# Altium project Arduino Board.PrjPcb
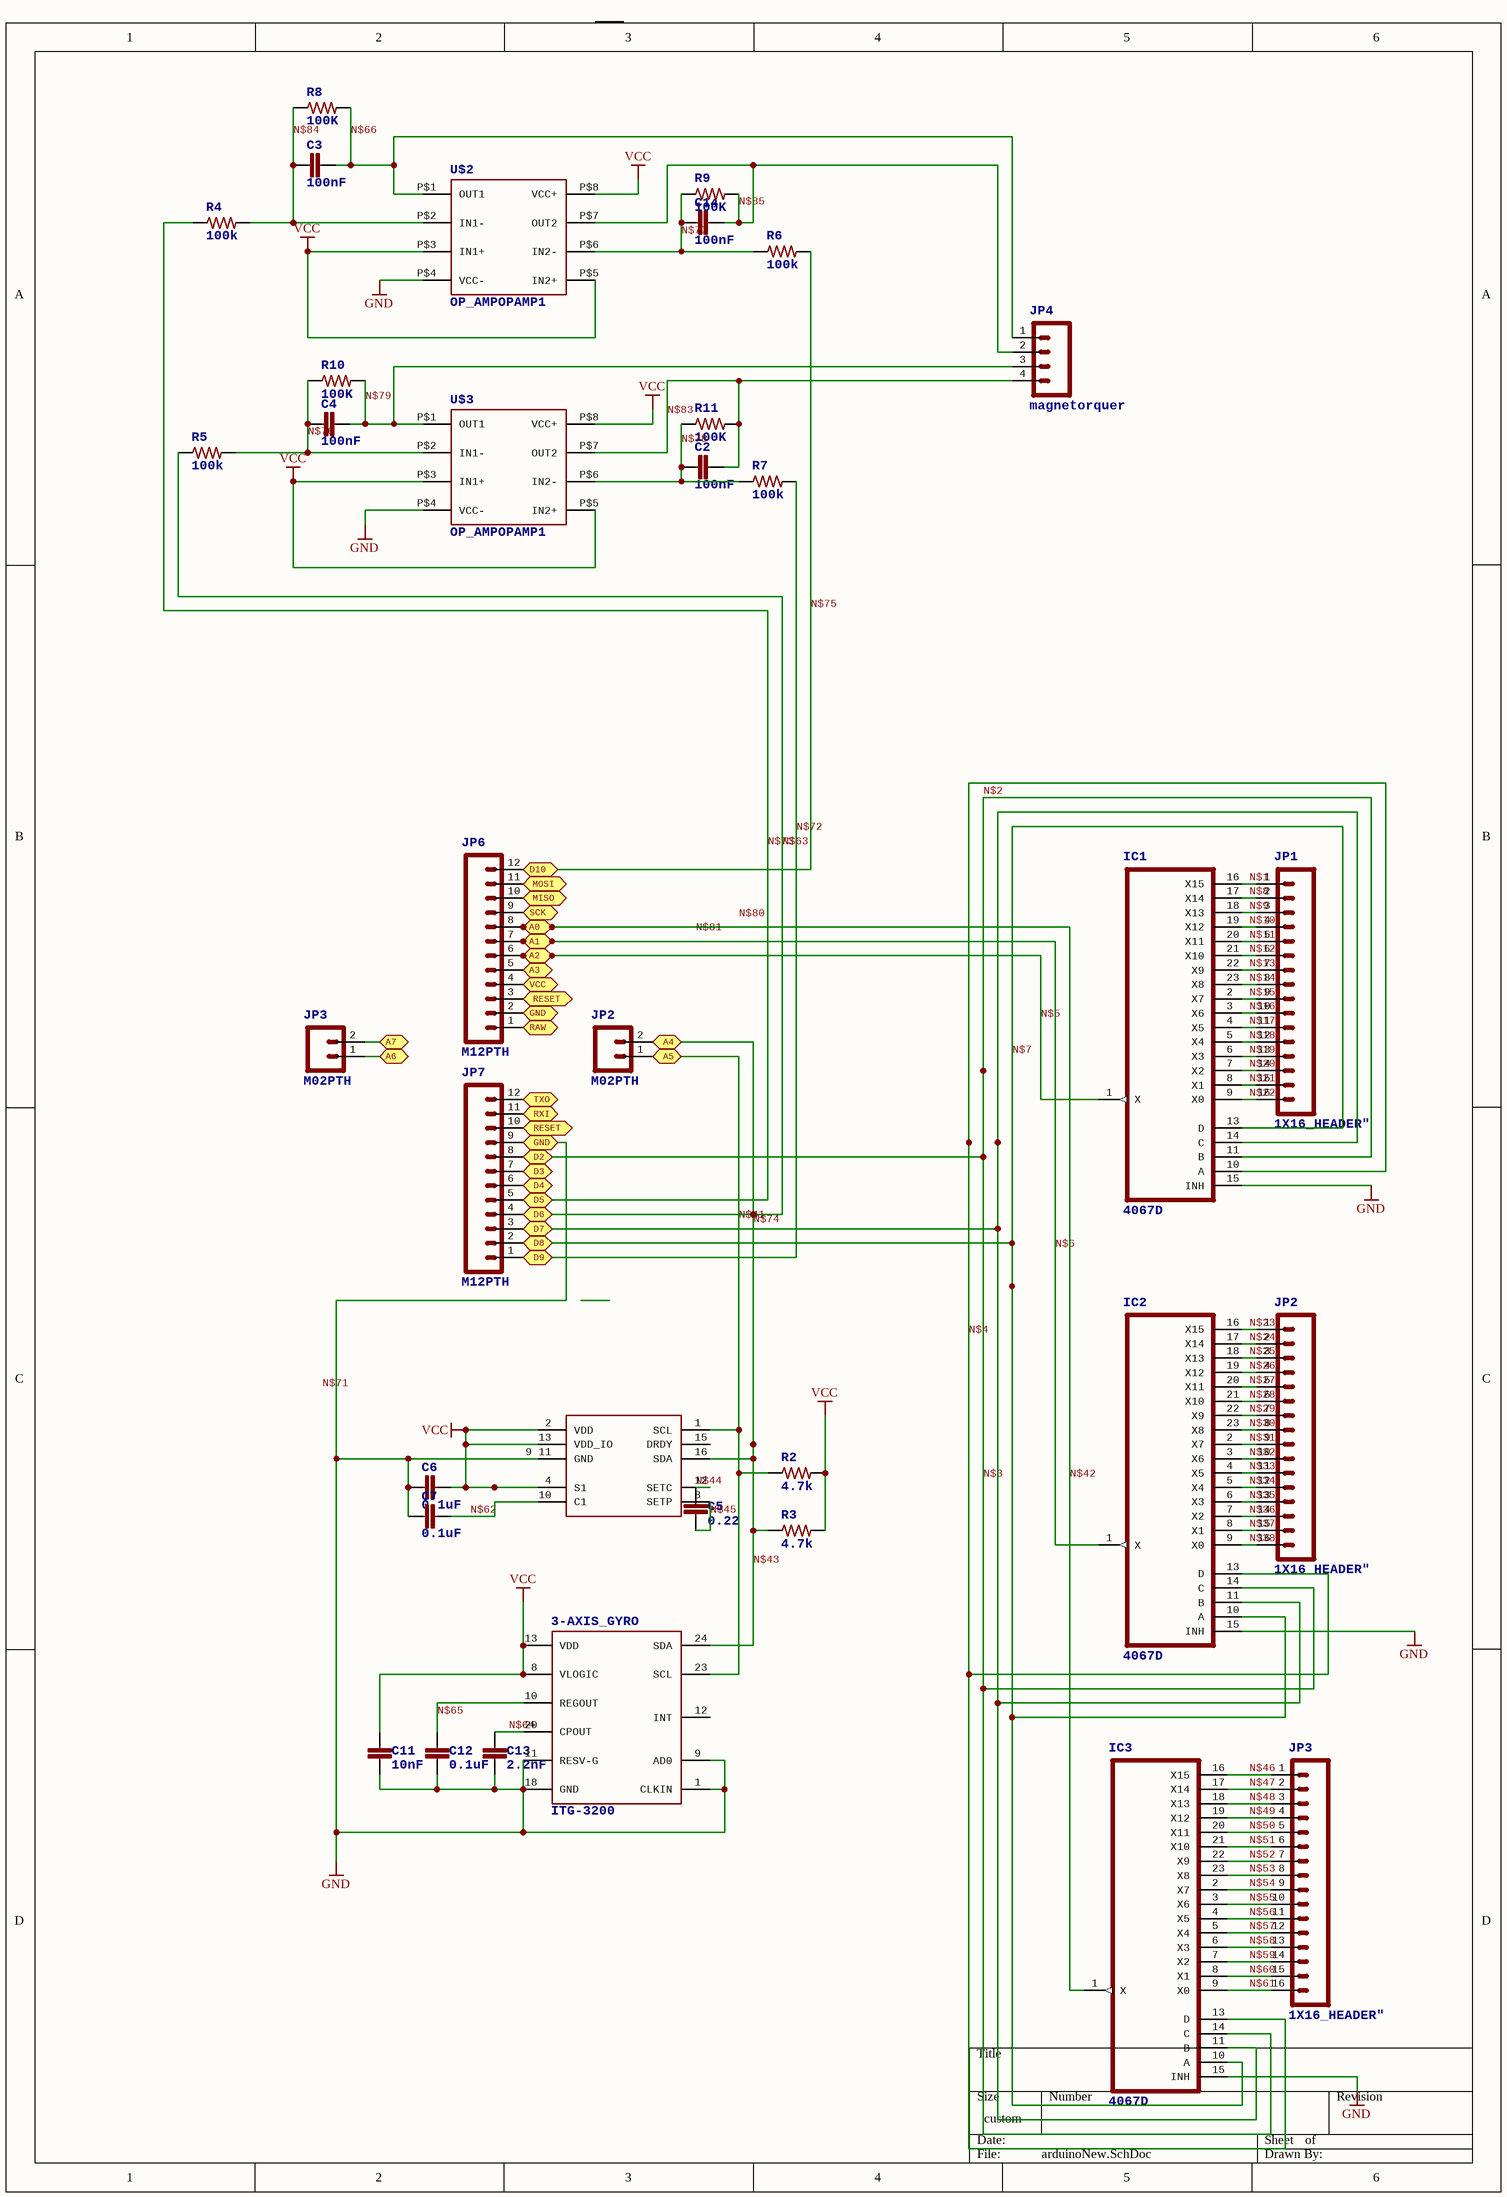
[diagram p0: arduinoNew.SchDoc]
4 sheets, 122 parts. Net scope: flat (ports and power ports of the same name join across sheets).
Sheets:
  arduinoNew.SchDoc
  arduino.SchDoc
  Arduino-Pro-Mini.SchDoc
  magnetorquer_shield.SchDoc

## Sheet arduinoNew.SchDoc
size 264 x 383 mm

### Parts
(Parts that share a designator on the sheet are numbered #1, #2 ... from top to bottom, then left to right.)
3-AXIS_GYRO#1  ITG-3200  [QFN-24]
3-AXIS_MAG#1  HMC5883L  [LPCC16]  (value not drawn)
C2#1  100nF  [0402-CAP]
C3#1  100nF  [0402-CAP]
C4#1  100nF  [0402-CAP]
C5#1  0.22  [0402-CAP]
C6#1  0.1uF  [0402-CAP]
C7#1  0.1uF  [0402-CAP]
C11#1  10nF  [0402-CAP]
C12#1  0.1uF  [0402-CAP]
C13#1  2.2nF  [0402-CAP]
C14#1  100nF  [0402-CAP]
IC1#1  4067D  [SO24W]
IC2#1  4067D  [SO24W]
IC3#1  4067D  [SO24W]
JP1#1  1X16_HEADER"  [1X16_HEADER]
JP2#1  M02PTH  [1X02]
JP2#2  1X16_HEADER"  [1X16_HEADER]
JP3#1  M02PTH  [1X02]
JP3#2  1X16_HEADER"  [1X16_HEADER]
JP4#1  magnetorquer  [1X04_HEADER]
JP6#1  M12PTH  [1X12]
JP7#1  M12PTH  [1X12]
R2#1  4.7k  [0805]
R3#1  4.7k  [0805]
R4#1  100k  [0805]
R5#1  100k  [0805]
R6#1  100k  [0805]
R7#1  100k  [0805]
R8#1  100K  [0805]
R9#1  100K  [0805]
R10#1  100K  [0805]
R11#1  100K  [0805]
U$2#1  OP_AMPOPAMP1  [OPAMP]
U$3#1  OP_AMPOPAMP1  [OPAMP]

### Ports
A0, A1, A2, A3, A4, A5, A6, A7, D2, D3, D4, D5, D6, D7, D8, D9, D10, GND, MISO, MOSI, RAW, RESET, RXI, SCK, TXO, VCC

### Nets
GND: 3-AXIS_GYRO#1.1(CLKIN) 3-AXIS_GYRO#1.9(AD0) 3-AXIS_GYRO#1.11(RESV-G) 3-AXIS_GYRO#1.18(GND) 3-AXIS_MAG#1.9_11(GND) C6#1.1 C7#1.1 C11#1.2 C12#1.2 C13#1.2 IC1#1.15(INH) IC2#1.15(INH) IC3#1.15(INH) JP6#1.2 JP7#1.9 U$2#1.P$4(VCC-) U$3#1.P$4(VCC-) ; port GND
VCC: 3-AXIS_GYRO#1.8(VLOGIC) 3-AXIS_GYRO#1.13(VDD) 3-AXIS_MAG#1.2(VDD) 3-AXIS_MAG#1.4(S1) 3-AXIS_MAG#1.13(VDD_IO) C6#1.2 C11#1.1 R2#1.2 R3#1.2 U$2#1.P$3(IN1+) U$2#1.P$5(IN2+) U$2#1.P$8(VCC+) U$3#1.P$3(IN1+) U$3#1.P$5(IN2+) U$3#1.P$8(VCC+)
N$1: IC1#1.16(X15) JP1#1.1
N$2: IC1#1.11(B) IC2#1.14(C) IC3#1.14(C) JP7#1.8 ; port D2  [also labelled N$3]
N$4: IC1#1.10(A) IC2#1.13(D) IC3#1.13(D)
N$5: IC1#1.1(X) JP6#1.6 ; port A2
N$6: IC2#1.1(X) JP6#1.7 ; port A1
N$7: IC1#1.13(D) IC2#1.10(A) IC3#1.10(A) JP7#1.2 ; port D8
N$8: IC1#1.17(X14) JP1#1.2
N$9: IC1#1.18(X13) JP1#1.3
N$10: IC1#1.19(X12) JP1#1.4
N$11: IC1#1.20(X11) JP1#1.5
N$12: IC1#1.21(X10) JP1#1.6
N$13: IC1#1.22(X9) JP1#1.7
N$14: IC1#1.23(X8) JP1#1.8
N$15: IC1#1.2(X7) JP1#1.9
N$16: IC1#1.3(X6) JP1#1.10
N$17: IC1#1.4(X5) JP1#1.11
N$18: IC1#1.5(X4) JP1#1.12
N$19: IC1#1.6(X3) JP1#1.13
N$20: IC1#1.7(X2) JP1#1.14
N$21: IC1#1.8(X1) JP1#1.15
N$22: IC1#1.9(X0) JP1#1.16
N$23: IC2#1.16(X15) JP2#2.1
N$24: IC2#1.17(X14) JP2#2.2
N$25: IC2#1.18(X13) JP2#2.3
N$26: IC2#1.19(X12) JP2#2.4
N$27: IC2#1.20(X11) JP2#2.5
N$28: IC2#1.21(X10) JP2#2.6
N$29: IC2#1.22(X9) JP2#2.7
N$30: IC2#1.23(X8) JP2#2.8
N$31: IC2#1.2(X7) JP2#2.9
N$32: IC2#1.3(X6) JP2#2.10
N$33: IC2#1.4(X5) JP2#2.11
N$34: IC2#1.5(X4) JP2#2.12
N$35: IC2#1.6(X3) JP2#2.13
N$36: IC2#1.7(X2) JP2#2.14
N$37: IC2#1.8(X1) JP2#2.15
N$38: IC2#1.9(X0) JP2#2.16
N$41: 3-AXIS_GYRO#1.23(SCL) 3-AXIS_MAG#1.1(SCL) JP2#1.1 R2#1.1 ; port A5
N$42: IC3#1.1(X) JP6#1.8 ; port A0
N$43: 3-AXIS_GYRO#1.24(SDA) 3-AXIS_MAG#1.16(SDA) JP2#1.2 JP7#1.4 R3#1.1 R5#1.1 ; port D6, port A4  [also labelled N$63, N$74]
N$44: 3-AXIS_MAG#1.12(SETC) C5#1.1
N$45: 3-AXIS_MAG#1.8(SETP) C5#1.2
N$46: IC3#1.16(X15) JP3#2.1
N$47: IC3#1.17(X14) JP3#2.2
N$48: IC3#1.18(X13) JP3#2.3
N$49: IC3#1.19(X12) JP3#2.4
N$50: IC3#1.20(X11) JP3#2.5
N$51: IC3#1.21(X10) JP3#2.6
N$52: IC3#1.22(X9) JP3#2.7
N$53: IC3#1.23(X8) JP3#2.8
N$54: IC3#1.2(X7) JP3#2.9
N$55: IC3#1.3(X6) JP3#2.10
N$56: IC3#1.4(X5) JP3#2.11
N$57: IC3#1.5(X4) JP3#2.12
N$58: IC3#1.6(X3) JP3#2.13
N$59: IC3#1.7(X2) JP3#2.14
N$60: IC3#1.8(X1) JP3#2.15
N$61: IC3#1.9(X0) JP3#2.16
N$62: 3-AXIS_MAG#1.10(C1) C7#1.2
N$64: 3-AXIS_GYRO#1.20(CPOUT) C13#1.1
N$65: 3-AXIS_GYRO#1.10(REGOUT) C12#1.1
N$66: C3#1.2 JP4#1.1 R8#1.2 U$2#1.P$1(OUT1)
N$72: JP7#1.1 R7#1.2 ; port D9
N$73: JP7#1.5 R4#1.1 ; port D5
N$75: JP6#1.12 R6#1.2 ; port D10
N$76: C4#1.1 R5#1.2 R10#1.1 U$3#1.P$2(IN1-)
N$77: C14#1.1 R6#1.1 R9#1.1 U$2#1.P$6(IN2-)
N$78: C2#1.1 R7#1.1 R11#1.1 U$3#1.P$6(IN2-)
N$79: C4#1.2 JP4#1.3 R10#1.2 U$3#1.P$1(OUT1)
N$83: C2#1.2 JP4#1.4 R11#1.2 U$3#1.P$7(OUT2)
N$84: C3#1.1 R4#1.2 R8#1.1 U$2#1.P$2(IN1-)
N$85: C14#1.2 JP4#1.2 R9#1.2 U$2#1.P$7(OUT2)
NetC19_A: JP6#1.1 ; port RAW
NetIC1#1_14: IC1#1.14(C) IC2#1.11(B) IC3#1.11(B) JP7#1.3 ; port D7
NetJP1#3_2: JP7#1.12 ; port TXO
NetJP1#3_3: JP7#1.11 ; port RXI
NetJP1#3_4: JP6#1.4 ; port VCC
NetJP3#1_1: JP3#1.1 ; port A6
NetJP3#1_2: JP3#1.2 ; port A7
NetJP6#1_3: JP6#1.3 JP7#1.10 ; port RESET
NetJP6#1_5: JP6#1.5 ; port A3
NetJP6#1_9: JP6#1.9 ; port SCK
NetJP6#1_10: JP6#1.10 ; port MISO
NetJP6#1_11: JP6#1.11 ; port MOSI
NetJP7#1_6: JP7#1.6 ; port D4
NetJP7#1_7: JP7#1.7 ; port D3

Not connected (* = marked no-connect by the designer): 3-AXIS_GYRO#1 12(INT); 3-AXIS_MAG#1 15(DRDY)

### Notes on the sheet
- Labels drawn without touching a wire or pin: N$71, N$80, N$81

### Library data of the parts
3-AXIS_GYRO#1 = ITG-3200: ITG-3200 3-axis gyro, digital output, qfn24 package
C2#1 C3#1 C4#1 C5#1 C6#1 C7#1 C11#1 C12#1 C13#1 C14#1 = CAP0402-CAP: CapacitorStandard 0603 ceramic capacitor, and 0.1" leaded capacitor.
IC1#1 IC2#1 IC3#1 = 4067D: 16-channel ANALOG MULTIPLEXER
JP2#1 JP3#1 = M02PTH: Header 2Standard 2-pin 0.1" header. Use with straight break away headers (SKU : PRT-00116), right angle break away headers (PRT-00553), swiss pins (PRT-00743), machine pins (PRT-00117), and female headers (PRT-00115). Molex polarized connector foot print use with SKU : PRT-08233 with associated crimp pins and housings.
JP4#1 = 1X04_HEADER": Header 4Standard 4-pin 0.1" header. Use with straight break away headers (SKU : PRT-00116), right angle break away headers (PRT-00553), swiss pins (PRT-00743), machine pins (PRT-00117), and female headers (PRT-00115). Molex polarized connector foot print use with SKU : PRT-08231 with associated crimp pins and housings.
JP6#1 JP7#1 = M12PTH: Header 12Standard 12-pin 0.1" header. Use with straight break away headers (SKU : PRT-00116), right angle break away headers (PRT-00553), swiss pins (PRT-00743), machine pins (PRT-00117), and female headers (PRT-00115).
R2#1 R3#1 R4#1 R5#1 R6#1 R7#1 R8#1 R9#1 R10#1 R11#1 = RESISTOR: ResistorBasic schematic elements and footprints for 0603, 1206, and PTH 1/10th watt (small) resistors.

## Sheet arduino.SchDoc
size 264 x 383 mm
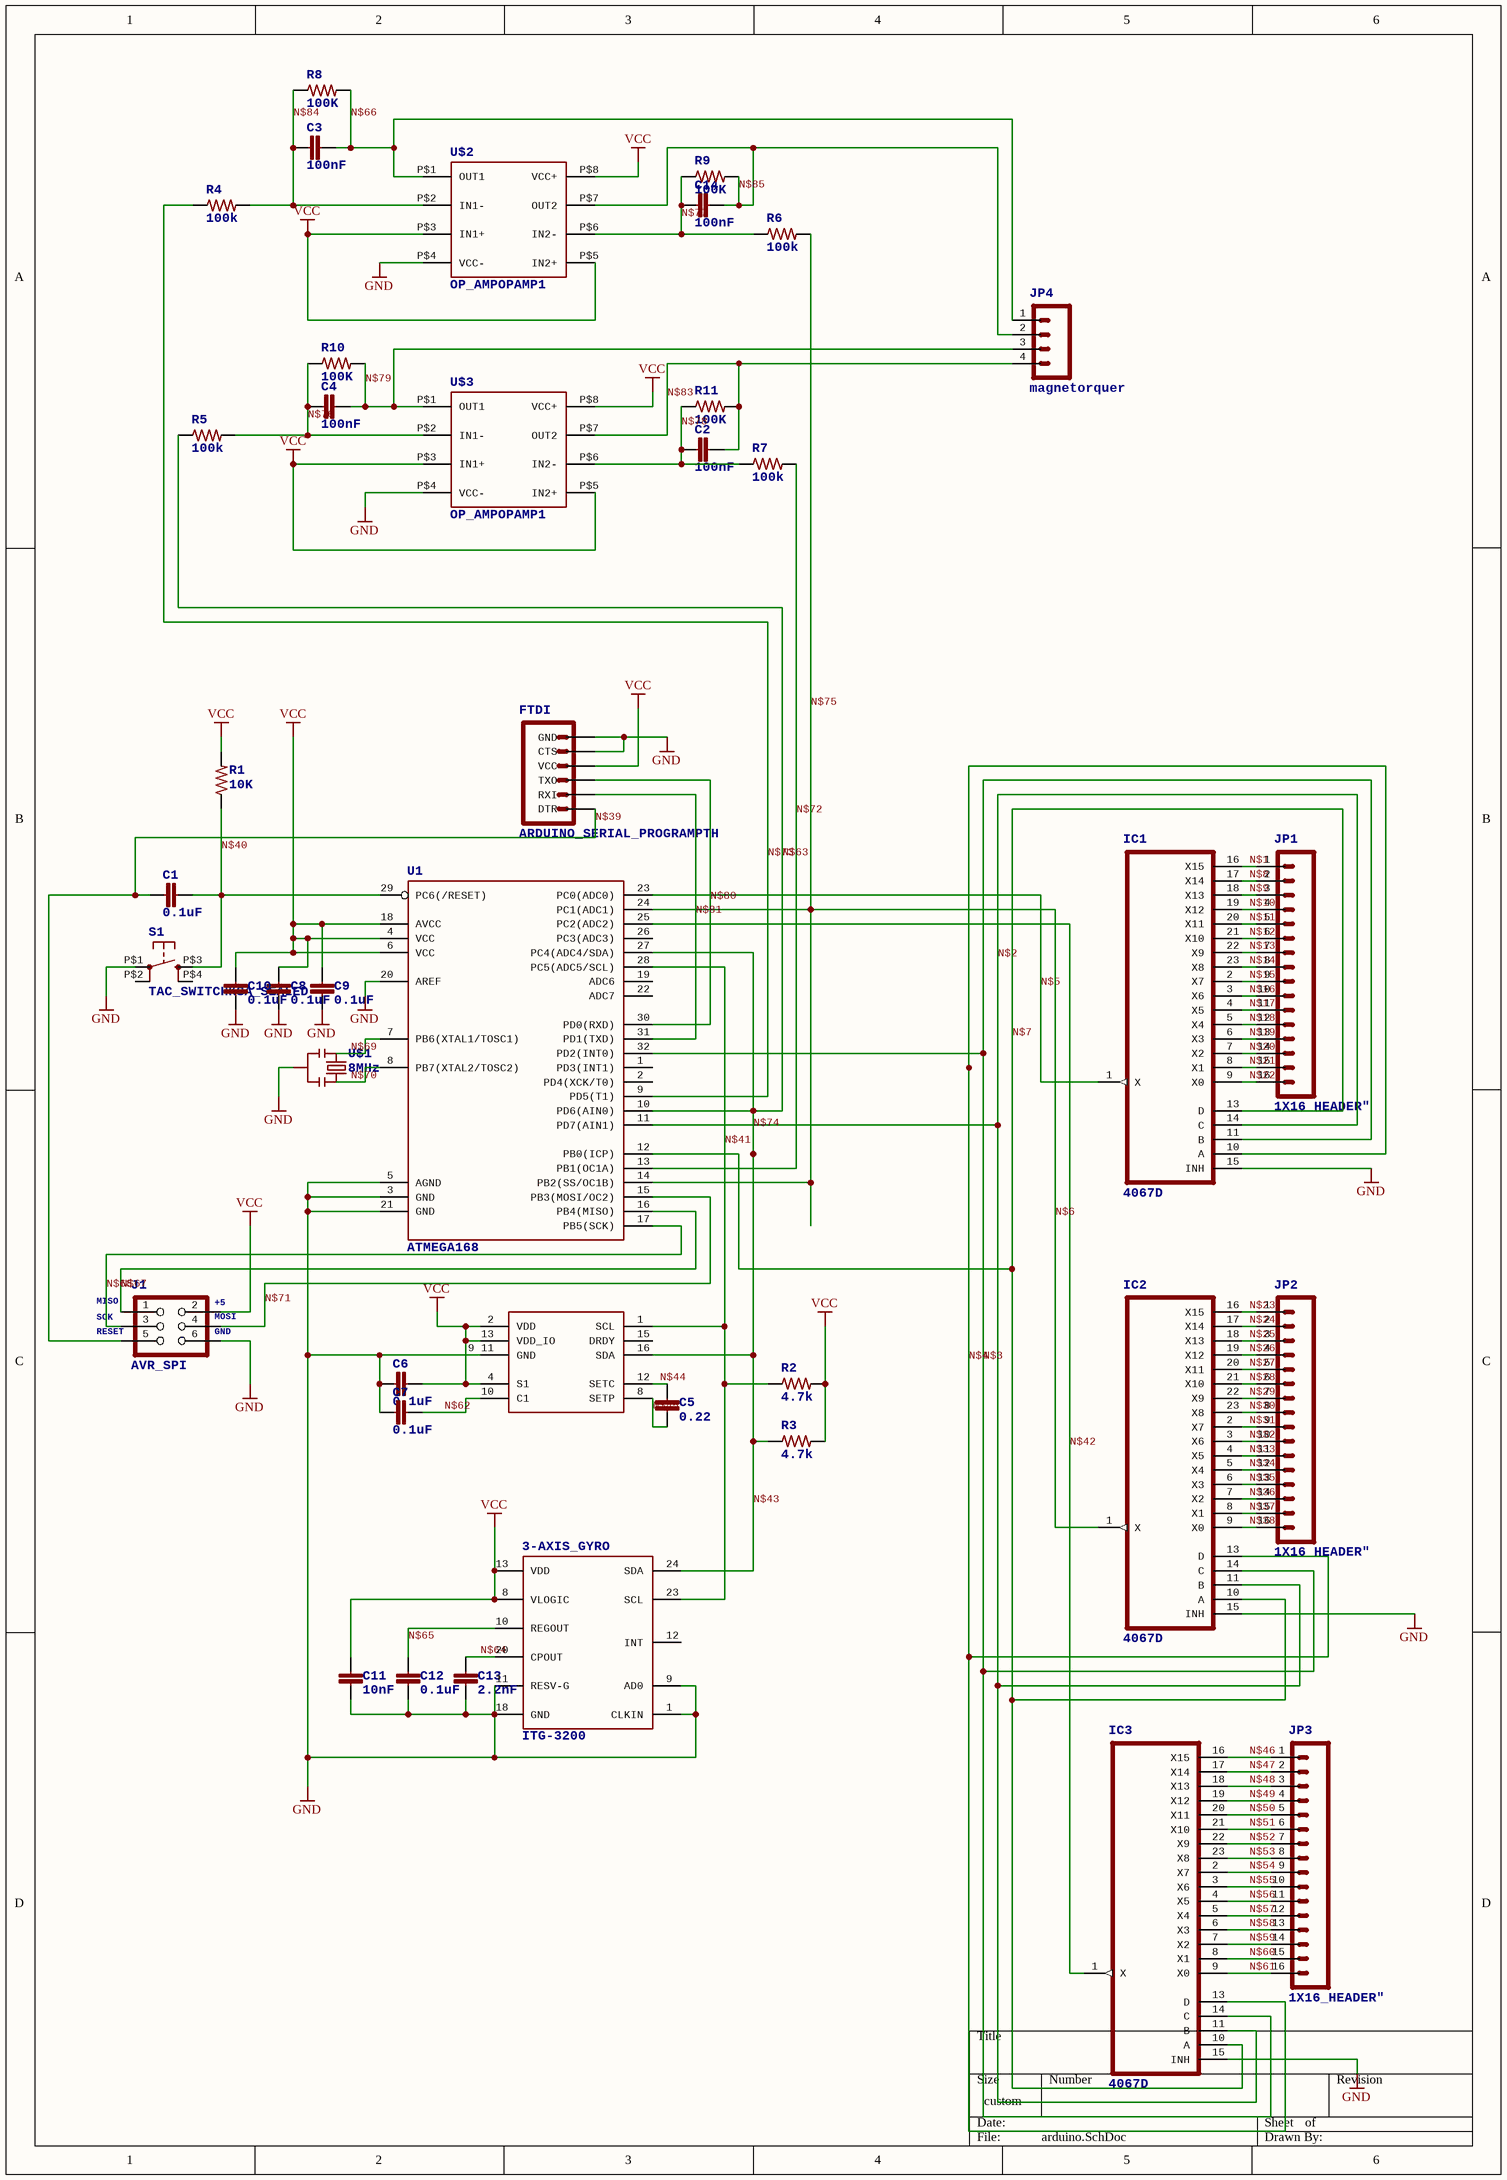
[diagram p1: arduino.SchDoc]

### Parts
(Parts that share a designator on the sheet are numbered #1, #2 ... from top to bottom, then left to right.)
3-AXIS_GYRO#2  ITG-3200  [QFN-24]
3-AXIS_MAG#2  HMC5883L  [LPCC16]  (value not drawn)
C1#1  0.1uF  [0603-CAP]
C2#2  100nF  [0402-CAP]
C3#2  100nF  [0402-CAP]
C4#2  100nF  [0402-CAP]
C5#2  0.22  [0402-CAP]
C6#2  0.1uF  [0402-CAP]
C7#2  0.1uF  [0402-CAP]
C8  0.1uF  [0603-CAP]
C9  0.1uF  [0603-CAP]
C10#1  0.1uF  [0603-CAP]
C11#2  10nF  [0402-CAP]
C12#2  0.1uF  [0402-CAP]
C13#2  2.2nF  [0402-CAP]
C14#2  100nF  [0402-CAP]
FTDI  ARDUINO_SERIAL_PROGRAMPTH  [1X06]
IC1#2  4067D  [SO24W]
IC2#2  4067D  [SO24W]
IC3#2  4067D  [SO24W]
J1  AVR_SPI  [2X3]
JP1#2  1X16_HEADER"  [1X16_HEADER]
JP2#3  1X16_HEADER"  [1X16_HEADER]
JP3#3  1X16_HEADER"  [1X16_HEADER]
JP4#2  magnetorquer  [1X04_HEADER]
R1#1  10K  [0805]
R2#2  4.7k  [0805]
R3#2  4.7k  [0805]
R4#2  100k  [0805]
R5#2  100k  [0805]
R6#2  100k  [0805]
R7#2  100k  [0805]
R8#2  100K  [0805]
R9#2  100K  [0805]
R10#2  100K  [0805]
R11#2  100K  [0805]
S1#1  TAC_SWITCHKSA_SEALED  [KSA_SEALED_TAC_SWITCH]
U1#1  ATMEGA168  [TQFP32-08]
U$1#1  8MHz  [RESONATOR]
U$2#2  OP_AMPOPAMP1  [OPAMP]
U$3#2  OP_AMPOPAMP1  [OPAMP]

### Nets
GND: 3-AXIS_GYRO#2.1(CLKIN) 3-AXIS_GYRO#2.9(AD0) 3-AXIS_GYRO#2.11(RESV-G) 3-AXIS_GYRO#2.18(GND) 3-AXIS_MAG#2.9_11(GND) C6#2.1 C7#2.1 C8.2 C9.2 C10#1.2 C11#2.2 C12#2.2 C13#2.2 FTDI.5(CTS) FTDI.6(GND) IC1#2.15(INH) IC2#2.15(INH) IC3#2.15(INH) J1.6 S1#1.P$1 U1#1.3(GND) U1#1.5(AGND) U1#1.20(AREF) U1#1.21(GND) U$1#1.2 U$2#2.P$4(VCC-) U$3#2.P$4(VCC-)
VCC: 3-AXIS_GYRO#2.8(VLOGIC) 3-AXIS_GYRO#2.13(VDD) 3-AXIS_MAG#2.2(VDD) 3-AXIS_MAG#2.4(S1) 3-AXIS_MAG#2.13(VDD_IO) C6#2.2 C8.1 C9.1 C10#1.1 C11#2.1 FTDI.4(VCC) J1.2 R1#1.2 R2#2.2 R3#2.2 U1#1.4(VCC) U1#1.6(VCC) U1#1.18(AVCC) U$2#2.P$3(IN1+) U$2#2.P$5(IN2+) U$2#2.P$8(VCC+) U$3#2.P$3(IN1+) U$3#2.P$5(IN2+) U$3#2.P$8(VCC+)
N$1: IC1#2.16(X15) JP1#2.1
N$2: IC1#2.14(C) IC2#2.11(B) IC3#2.11(B) U1#1.11(PD7(AIN1))
N$3: IC1#2.11(B) IC2#2.14(C) IC3#2.14(C) U1#1.32(PD2(INT0))
N$4: IC1#2.10(A) IC2#2.13(D) IC3#2.13(D)
N$5: IC1#2.1(X) U1#1.23(PC0(ADC0))
N$6: IC2#2.1(X) R6#2.2 U1#1.14(PB2(SS/OC1B)) U1#1.24(PC1(ADC1))  [also labelled N$75]
N$7: IC1#2.13(D) IC2#2.10(A) IC3#2.10(A) U1#1.12(PB0(ICP))
N$8: IC1#2.17(X14) JP1#2.2
N$9: IC1#2.18(X13) JP1#2.3
N$10: IC1#2.19(X12) JP1#2.4
N$11: IC1#2.20(X11) JP1#2.5
N$12: IC1#2.21(X10) JP1#2.6
N$13: IC1#2.22(X9) JP1#2.7
N$14: IC1#2.23(X8) JP1#2.8
N$15: IC1#2.2(X7) JP1#2.9
N$16: IC1#2.3(X6) JP1#2.10
N$17: IC1#2.4(X5) JP1#2.11
N$18: IC1#2.5(X4) JP1#2.12
N$19: IC1#2.6(X3) JP1#2.13
N$20: IC1#2.7(X2) JP1#2.14
N$21: IC1#2.8(X1) JP1#2.15
N$22: IC1#2.9(X0) JP1#2.16
N$23: IC2#2.16(X15) JP2#3.1
N$24: IC2#2.17(X14) JP2#3.2
N$25: IC2#2.18(X13) JP2#3.3
N$26: IC2#2.19(X12) JP2#3.4
N$27: IC2#2.20(X11) JP2#3.5
N$28: IC2#2.21(X10) JP2#3.6
N$29: IC2#2.22(X9) JP2#3.7
N$30: IC2#2.23(X8) JP2#3.8
N$31: IC2#2.2(X7) JP2#3.9
N$32: IC2#2.3(X6) JP2#3.10
N$33: IC2#2.4(X5) JP2#3.11
N$34: IC2#2.5(X4) JP2#3.12
N$35: IC2#2.6(X3) JP2#3.13
N$36: IC2#2.7(X2) JP2#3.14
N$37: IC2#2.8(X1) JP2#3.15
N$38: IC2#2.9(X0) JP2#3.16
N$39: C1#1.1 FTDI.1(DTR) J1.5
N$40: C1#1.2 R1#1.1 S1#1.P$3 U1#1.29(PC6(/RESET))
N$41: 3-AXIS_GYRO#2.23(SCL) 3-AXIS_MAG#2.1(SCL) R2#2.1 U1#1.28(PC5(ADC5/SCL))
N$42: IC3#2.1(X) U1#1.25(PC2(ADC2))
N$43: 3-AXIS_GYRO#2.24(SDA) 3-AXIS_MAG#2.16(SDA) R3#2.1 R5#2.1 U1#1.10(PD6(AIN0)) U1#1.27(PC4(ADC4/SDA))  [also labelled N$63, N$74]
N$44: 3-AXIS_MAG#2.12(SETC) C5#2.1
N$45: 3-AXIS_MAG#2.8(SETP) C5#2.2
N$46: IC3#2.16(X15) JP3#3.1
N$47: IC3#2.17(X14) JP3#3.2
N$48: IC3#2.18(X13) JP3#3.3
N$49: IC3#2.19(X12) JP3#3.4
N$50: IC3#2.20(X11) JP3#3.5
N$51: IC3#2.21(X10) JP3#3.6
N$52: IC3#2.22(X9) JP3#3.7
N$53: IC3#2.23(X8) JP3#3.8
N$54: IC3#2.2(X7) JP3#3.9
N$55: IC3#2.3(X6) JP3#3.10
N$56: IC3#2.4(X5) JP3#3.11
N$57: IC3#2.5(X4) JP3#3.12
N$58: IC3#2.6(X3) JP3#3.13
N$59: IC3#2.7(X2) JP3#3.14
N$60: IC3#2.8(X1) JP3#3.15
N$61: IC3#2.9(X0) JP3#3.16
N$62: 3-AXIS_MAG#2.10(C1) C7#2.2
N$64: 3-AXIS_GYRO#2.20(CPOUT) C13#2.1
N$65: 3-AXIS_GYRO#2.10(REGOUT) C12#2.1
N$66: C3#2.2 JP4#2.1 R8#2.2 U$2#2.P$1(OUT1)
N$67: J1.1 U1#1.16(PB4(MISO))
N$68: J1.3 U1#1.17(PB5(SCK))
N$69: U1#1.7(PB6(XTAL1/TOSC1)) U$1#1.1
N$70: U1#1.8(PB7(XTAL2/TOSC2)) U$1#1.3
N$71: J1.4 U1#1.15(PB3(MOSI/OC2))
N$72: R7#2.2 U1#1.13(PB1(OC1A))
N$73: R4#2.1 U1#1.9(PD5(T1))
N$76: C4#2.1 R5#2.2 R10#2.1 U$3#2.P$2(IN1-)
N$77: C14#2.1 R6#2.1 R9#2.1 U$2#2.P$6(IN2-)
N$78: C2#2.1 R7#2.1 R11#2.1 U$3#2.P$6(IN2-)
N$79: C4#2.2 JP4#2.3 R10#2.2 U$3#2.P$1(OUT1)
N$80: FTDI.3(TXO) U1#1.30(PD0(RXD))
N$81: FTDI.2(RXI) U1#1.31(PD1(TXD))
N$83: C2#2.2 JP4#2.4 R11#2.2 U$3#2.P$7(OUT2)
N$84: C3#2.1 R4#2.2 R8#2.1 U$2#2.P$2(IN1-)
N$85: C14#2.2 JP4#2.2 R9#2.2 U$2#2.P$7(OUT2)

Not connected (* = marked no-connect by the designer): 3-AXIS_GYRO#2 12(INT); 3-AXIS_MAG#2 15(DRDY); S1#1 P$2(2) P$4(4); U1#1 1(PD3(INT1)) 2(PD4(XCK/T0)) 19(ADC6) 22(ADC7) 26(PC3(ADC3))

### Library data of the parts
3-AXIS_GYRO#2 = ITG-3200: as 3-AXIS_GYRO#1 on sheet arduinoNew
C1#1 C8 C9 C10#1 = CAP0603-CAP: CapacitorStandard 0603 ceramic capacitor, and 0.1" leaded capacitor.
C2#2 C3#2 C4#2 C5#2 C6#2 C7#2 C11#2 C12#2 C13#2 C14#2 = CAP0402-CAP: as C2#1 on sheet arduinoNew
IC1#2 IC2#2 IC3#2 = 4067D: 16-channel ANALOG MULTIPLEXER
J1 = AVR_SPI_PRG_6PTH: AVR ISP 6 PinThis is the reduced ISP connector for AVR programming. Common on Arduino. This footprint will take up less PCB space and can be used with a 10-pin to 6-pin adapter such as SKU: BOB-08508; MOSI: MOSI; RESET: RESET; SCK: SCK; MISO: MISO; +5: +5; GND: GND
JP4#2 = 1X04_HEADER": as JP4#1 on sheet arduinoNew
R1#1 R2#2 R3#2 R4#2 R5#2 R6#2 R7#2 R8#2 R9#2 R10#2 R11#2 = RESISTOR: as R2#1 on sheet arduinoNew
S1#1 = TAC_SWITCHKSA_SEALED: Momentary SwitchButton commonly used for reset or general input. Spark Fun Electronics SKU : COM-00097
U$1#1 = RESONATOR": ResonatorSmall SMD resonator. This is the itty bitty 10/20MHz resonators with built in caps. CSTCE10M0G55 and CSTCE20M0V53. Footprint has been reviewed closely but hasn t been tested yet.'

## Sheet Arduino-Pro-Mini.SchDoc: Arduino-Pro-Mini
size 270 x 207 mm; Date: 2015-11-11 8:06:48 PM; SheetNumber: 1
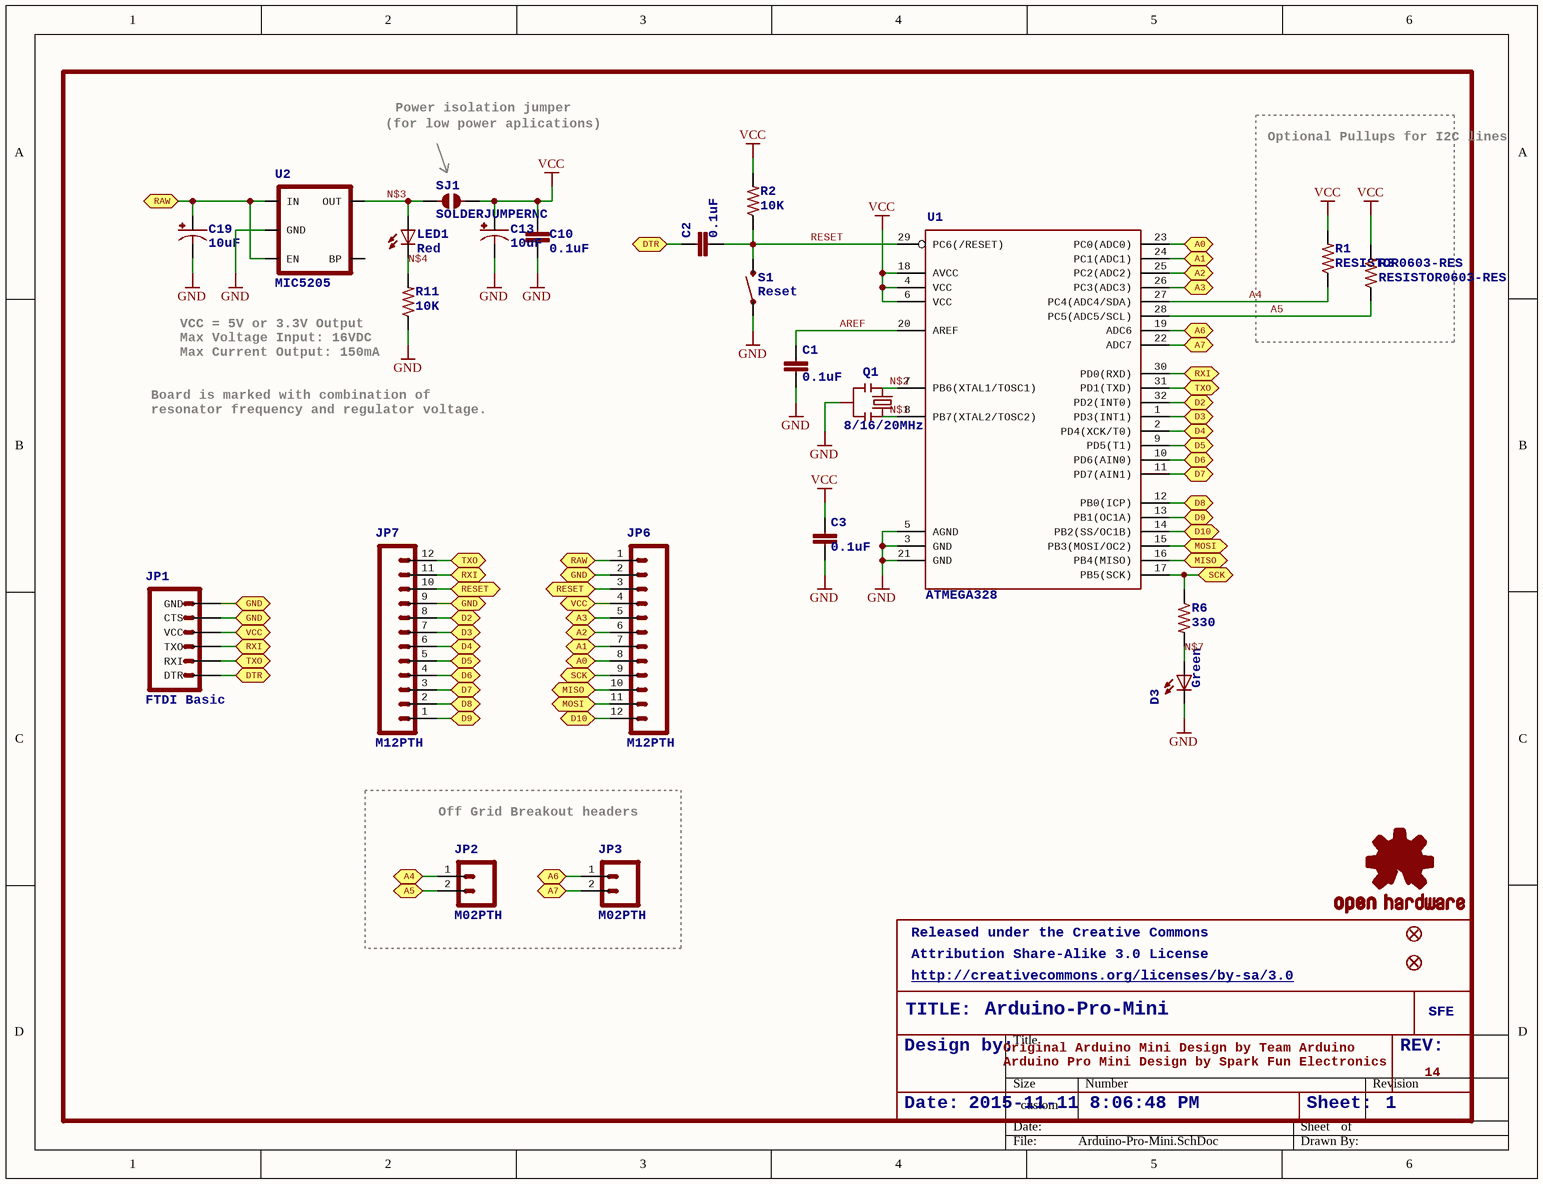
[diagram p2: Arduino-Pro-Mini.SchDoc]

### Parts
(Parts that share a designator on the sheet are numbered #1, #2 ... from top to bottom, then left to right.)
C1#2  0.1uF  [0603-CAP]
C2#3  0.1uF  [0603-CAP]
C3#3  0.1uF  [0603-CAP]
C10#2  0.1uF  [0603-CAP]
C13#3  10uF  [EIA3216]
C19  10uF  [EIA3216]
D3  Green  [0603-LED-ALT1]
JP1#3  FTDI Basic  [1X06]
JP2#4  M02PTH  [1X02]
JP3#4  M02PTH  [1X02]
JP5  FIDUCIALUFIDUCIAL  [MICRO-FIDUCIAL]  (value not drawn)
JP6#2  M12PTH  [1X12]
JP7#2  M12PTH  [1X12]
JP8  FIDUCIALUFIDUCIAL  [MICRO-FIDUCIAL]  (value not drawn)
LED1  Red  [0603-LED-ALT1]
Q1  8/16/20MHz  [RESONATOR-SMD-1:1]
R1#2  RESISTOR0603-RES  [0603-RES]
R2#3  10K  [0603-RES]
R3#3  RESISTOR0603-RES  [0603-RES]
R6#3  330  [0603-RES]
R11#3  10K  [0603-RES]
S1#2  Reset  [TACTILE-SWITCH-SMD-ALT01]
SJ1  SOLDERJUMPERNC  [SJ_2S]
U1#2  ATMEGA328  [TQFP32-08]
U2  MIC5205  [SOT23-5]
U$1#2  LOGO-SFESK  [SFE-LOGO-FLAME]  (value not drawn)
U$3#3  OSHW-LOGOS  [OSHW-LOGO-S]  (value not drawn)
U$11  LOGO-SFENEW  [SFE-NEW-WEBLOGO]  (value not drawn)

### Blocks framed on the sheet
Optional Pullups for I2C lines: R1#2 R3#3
Off Grid Breakout headers: JP2#4 JP3#4

### Ports
A0, A1, A2, A3, A4, A5, A6, A7, D2, D3, D4, D5, D6, D7, D8, D9, D10, DTR, GND, MISO, MOSI, RAW, RESET, RXI, SCK, TXO, VCC

### Nets
GND: C1#2.1 C3#3.1 C10#2.2 C13#3.C(-) C19.C(-) D3.C JP1#3.5(CTS) JP1#3.6(GND) JP6#2.2 JP7#2.9 Q1.2 R11#3.1 S1#2.1_2 U1#2.3(GND) U1#2.5(AGND) U1#2.21(GND) U2.2(GND) ; port GND
VCC: C3#3.2 C10#2.1 C13#3.A(+) R1#2.2 R2#3.2 R3#3.2 SJ1.2 U1#2.4(VCC) U1#2.6(VCC) U1#2.18(AVCC)
A4: R1#2.1 U1#2.27(PC4(ADC4/SDA))
A5: R3#3.1 U1#2.28(PC5(ADC5/SCL))
AREF: C1#2.2 U1#2.20(AREF)
N$1: Q1.3 U1#2.8(PB7(XTAL2/TOSC2))
N$2: JP7#2.8 U1#2.32(PD2(INT0)) ; port D2
N$2: Q1.1 U1#2.7(PB6(XTAL1/TOSC1))  [a separate net that carries the same name]
N$3: LED1.A SJ1.1 U2.5(OUT)
N$4: LED1.C R11#3.2
N$5: JP6#2.6 U1#2.25(PC2(ADC2)) ; port A2
N$6: JP6#2.7 U1#2.24(PC1(ADC1)) ; port A1
N$7: JP7#2.2 U1#2.12(PB0(ICP)) ; port D8
N$7: D3.A R6#3.2  [a separate net that carries the same name]
N$41: JP2#4.2 ; port A5
N$42: JP6#2.8 U1#2.23(PC0(ADC0)) ; port A0
N$43: JP2#4.1 JP7#2.4 U1#2.10(PD6(AIN0)) ; port A4, port D6
N$72: JP7#2.1 U1#2.13(PB1(OC1A)) ; port D9
N$73: JP7#2.5 U1#2.9(PD5(T1)) ; port D5
N$75: JP6#2.12 U1#2.14(PB2(SS/OC1B)) ; port D10
RESET: C2#3.1 R2#3.1 S1#2.3_4 U1#2.29(PC6(/RESET))
NetC2#3_2: C2#3.2 JP1#3.1(DTR) ; port DTR
NetC19_A: C19.A(+) JP6#2.1 U2.1(IN) U2.3(EN) ; port RAW
NetIC1#1_14: JP7#2.3 U1#2.11(PD7(AIN1)) ; port D7
NetJP1#3_2: JP1#3.2(RXI) JP7#2.12 U1#2.31(PD1(TXD)) ; port TXO
NetJP1#3_3: JP1#3.3(TXO) JP7#2.11 U1#2.30(PD0(RXD)) ; port RXI
NetJP1#3_4: JP1#3.4(VCC) JP6#2.4 ; port VCC
NetJP3#1_1: JP3#4.1 U1#2.19(ADC6) ; port A6
NetJP3#1_2: JP3#4.2 U1#2.22(ADC7) ; port A7
NetJP6#1_3: JP6#2.3 JP7#2.10 ; port RESET
NetJP6#1_5: JP6#2.5 U1#2.26(PC3(ADC3)) ; port A3
NetJP6#1_9: JP6#2.9 R6#3.1 U1#2.17(PB5(SCK)) ; port SCK
NetJP6#1_10: JP6#2.10 U1#2.16(PB4(MISO)) ; port MISO
NetJP6#1_11: JP6#2.11 U1#2.15(PB3(MOSI/OC2)) ; port MOSI
NetJP7#1_6: JP7#2.6 U1#2.2(PD4(XCK/T0)) ; port D4
NetJP7#1_7: JP7#2.7 U1#2.1(PD3(INT1)) ; port D3

Not connected (* = marked no-connect by the designer): U2 4(BP)

### Notes on the sheet
- (for low power aplications)
- Power isolation jumper
- Max Voltage Input: 16VDC
- VCC = 5V or 3.3V Output
- Board is marked with combination of
- resonator frequency and regulator voltage.
- Max Current Output: 150mA
- Released under the Creative Commons
- Attribution Share-Alike 3.0 License
- http://creativecommons.org/licenses/by-sa/3.0
- Design by:
- TITLE:
- Original Arduino Mini Design by Team Arduino
- Arduino Pro Mini Design by Spark Fun Electronics
- REV:
- Date:
- Sheet:
- 14

### Library data of the parts
C1#2 C2#3 C3#3 C10#2 = CAP0603-CAP: as C1#1 on sheet arduino
C13#3 C19 = CAP_POL1206: Capacitor PolarizedThese are standard SMD and PTH capacitors. Normally 10uF, 47uF, and 100uF in electrolytic and tantalum varieties. Always verify the external diameter of the through hole cap, it varies with capacity, voltage, and manufacturer. The EIA devices should be standard.
D3 LED1 = LED: LEDsStandard schematic elements and footprints for 5mm, 3mm, 1206, and 0603 sized LEDs. 5mm - Spark Fun Electronics SKU : COM-00529 (and others)
JP1#3 = ARDUINO_SERIAL_PROGRAMPTH
JP2#4 JP3#4 = M02PTH: as JP2#1 on sheet arduinoNew
JP5 JP8 = FIDUCIALUFIDUCIAL: Fiducial Alignment PointsVarious fiducial points for machine vision alignment.
JP6#2 JP7#2 = M12PTH: as JP6#1 on sheet arduinoNew
Q1 = RESONATOR1:1: ResonatorSmall SMD resonator. This is the itty bitty 10/20MHz resonators with built in caps. CSTCE10M0G55 and CSTCE20M0V53. Footprint for SMD has been used in SFE production for years, and does work okay. 1:1 is an attempt to get larger fillets on the sides so it will be easier to inspect these solders in our AOI machine. The pads have been minimized to match the actual metal under the resonator. To see this relation, it includes an image import of the bottom side of the component. Imported to scale on layer 200.
R1#2 R2#3 R3#3 R6#3 R11#3 = RESISTOR0603-RES: ResistorBasic schematic elements and footprints for 0603, 1206, and PTH resistors.
S1#2 = SWITCH-MOMENTARY-2SMD-ALT01: Various NO switches- pushbuttons, reed, etc
SJ1 = SOLDERJUMPERNC: Solder JumperStandard SMD solder jumper. Used to automate production. Two varients : Normally Open and Normally Closed are the same, but have different paste layers. NC will have a large amount of paste and should jumper during reflow.
U1#2 = ATMEGA168
U2 = V_REG_LDOSMD: Voltage Regulator LDOStandard 150mA LDO voltage regulator in SOT-23 layout. Micrel part MIC5205. BP (by-pass) pin is used to lower output noise with 470pF cap.
U$1#2 = LOGO-SFESK: Spark Fun Electronics PCB LogoThis is the standard Spark Fun Electronics PCB logo.; SFE: SFE
U$3#3 = OSHW-LOGOS: Open Source Hardware Logo This logo indicates the piece of hardware it is found on incorporates a OSHW license and/or adheres to the definition of open source hardware found here: http://freedomdefined.org/OSHW
U$11 = LOGO-SFENEW: Spark Fun Electronics PCB LogoThis is the standard Spark Fun Electronics PCB logo.; SFE: SFE

## Sheet magnetorquer_shield.SchDoc
size 381 x 241 mm
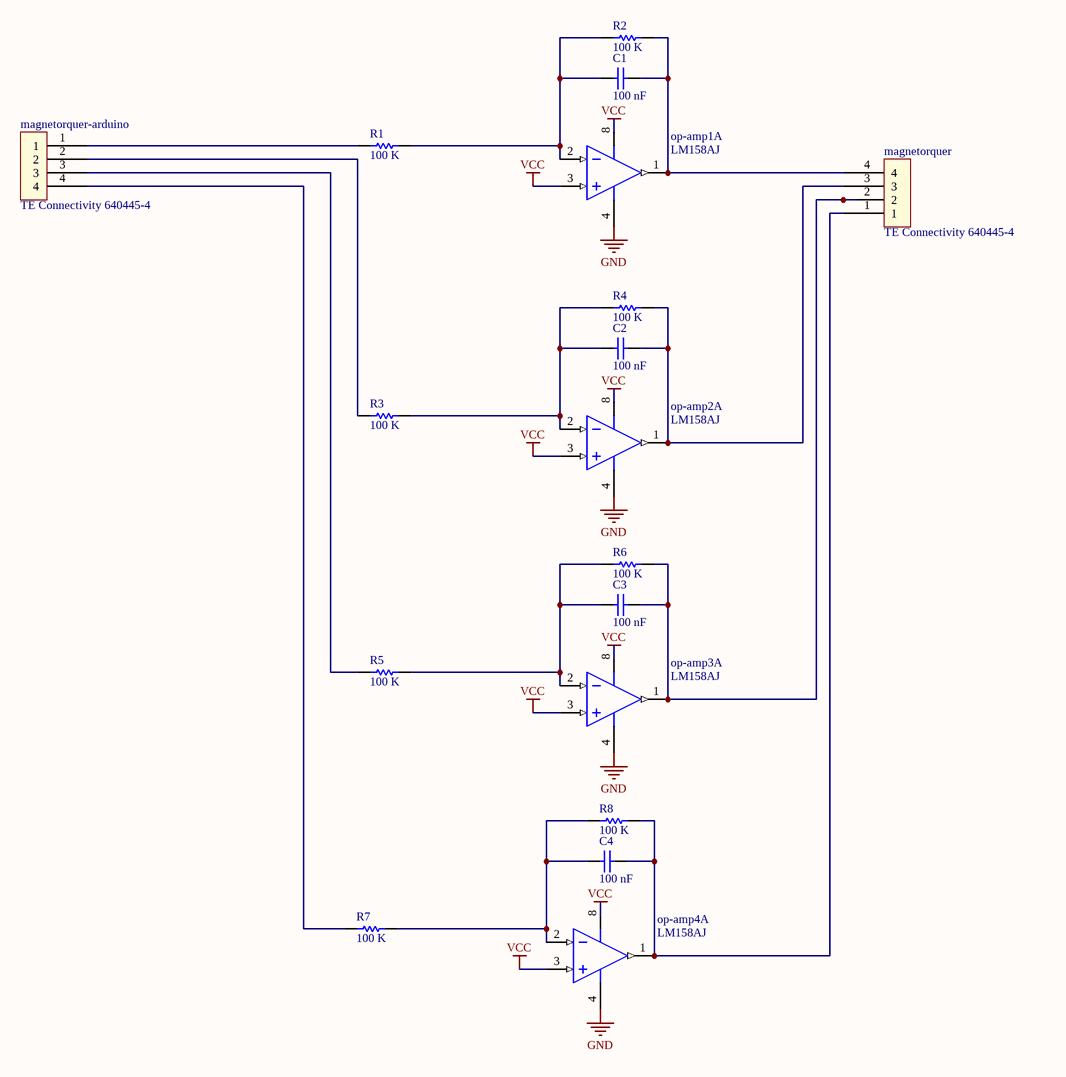
[diagram p3: magnetorquer_shield.SchDoc]

### Parts
(Parts that share a designator on the sheet are numbered #1, #2 ... from top to bottom, then left to right.)
C1#3  100 nF  [PCB-19299713-1]
C2#4  100 nF  [PCB-19299713-1]
C3#4  100 nF  [PCB-19299713-1]
C4#3  100 nF  [PCB-19299713-1]
magnetorquer  TE Connectivity 640445-4  [PCB-ri65nbe9iynob6pe1jn9-1]
magnetorquer-arduino  TE Connectivity 640445-4  [PCB-ri65nbe9iynob6pe1jn9-1]
op-amp1  LM158AJ  [J08A]  (part A of 2)
op-amp2  LM158AJ  [J08A]  (part A of 2)
op-amp3  LM158AJ  [J08A]  (part A of 2)
op-amp4  LM158AJ  [J08A]  (part A of 2)
R1#3  100 K  [RESC2013X50X30ML20T20]
R2#4  100 K  [RESC2013X50X30ML20T20]
R3#4  100 K  [RESC2013X50X30ML20T20]
R4#3  100 K  [RESC2013X50X30ML20T20]
R5#3  100 K  [RESC2013X50X30ML20T20]
R6#4  100 K  [RESC2013X50X30ML20T20]
R7#3  100 K  [RESC2013X50X30ML20T20]
R8#3  100 K  [RESC2013X50X30ML20T20]

### Nets
GND: op-amp1.4(GND) op-amp2.4(GND) op-amp3.4(GND) op-amp4.4(GND)
VCC: op-amp1.3(INA+) op-amp1.8(V+) op-amp2.3(INA+) op-amp2.8(V+) op-amp3.3(INA+) op-amp3.8(V+) op-amp4.3(INA+) op-amp4.8(V+)
NetC1#3_1: C1#3.1 op-amp1.2(INA-) R1#3.2 R2#4.1
NetC1#3_2: C1#3.2 magnetorquer.4 op-amp1.1(OUTA) R2#4.2
NetC2#4_1: C2#4.1 op-amp2.2(INA-) R3#4.2 R4#3.1
NetC2#4_2: C2#4.2 magnetorquer.3 op-amp2.1(OUTA) R4#3.2
NetC3#4_1: C3#4.1 op-amp3.2(INA-) R5#3.2 R6#4.1
NetC3#4_2: C3#4.2 magnetorquer.2 op-amp3.1(OUTA) R6#4.2
NetC4#3_1: C4#3.1 op-amp4.2(INA-) R7#3.2 R8#3.1
NetC4#3_2: C4#3.2 magnetorquer.1 op-amp4.1(OUTA) R8#3.2
Netmagnetorquer-arduino_1: magnetorquer-arduino.1 R1#3.1
Netmagnetorquer-arduino_2: magnetorquer-arduino.2 R3#4.1
Netmagnetorquer-arduino_3: magnetorquer-arduino.3 R5#3.1
Netmagnetorquer-arduino_4: magnetorquer-arduino.4 R7#3.1

### Library data of the parts
C1#3 C2#4 C3#4 C4#3 = CMP-19299713-2: CAP CER 0.1UF 16V 10% X7R 0603; Capacitance: 1e-07 F; Case/Package (SI): 1608; Lead-Free Status: Lead Free; Voltage Rating (DC): 16.0 V; Capacitance Tolerance: ±10%; Dielectric Characteristic: X7R; Lifecycle Status: Active; Mounting Style: Surface Mount; Number of Pins: 2; Octopart Url: https://octopart.com/grm188r71c104ka01d-murata-196247; OctopartID: d5b81cb00e490a7f; Packaging: Cut Tape (CT); REACH SVHC Compliance: No SVHC; RoHS: Compliant; Size-Height: 0.0008 m; Size-Length: 0.0016 m; Size-Thickness: 0.0008 m; Size-Width: 0.0008 m
magnetorquer magnetorquer-arduino = CMP-b6d87d170e53691f-2: MTA-156 4 Position 3.96 mm Single Row Through-Hole Straight Wire to Board Header; ELV Compliant: Compliant; Pin Pitch: 0.0039624 m; Voltage Rating (AC): 600.0 V; Mounting Angle: 180.0 °; Lead-Free Status: Lead Free; Gender: Male; Number of Contacts: 4; Current Rating: 7.0 A; Shrouded: No; Contact Plating: Tin; REACH SVHC Compliance: No SVHC; Manufacturer Part Number: 640445-4; Size-Length: 0.01585 m; Octopart URL: http://octopart.com/640445-4-te+connectivity-46505453; Housing Material: Polyester; Orientation: Vertical; RoHS: Compliant; Size-Width: 0.007747 m; Number of Rows: 1; Flammability Rating: UL 94 V-0; OctopartID: b6d87d170e53691f; Lifecycle Status: Active; Contact Material: Copper Alloy; Housing Color: Natural; Packaging: Bag; Number of Positions: 4; Size-Height: 0.010795 m; Mounting Style: Through Hole, Vertical
op-amp1-op-amp4 = LM158AJ: Low Power Dual Operational Amplifier, 8-pin CerDIP; Number of Channels: 2; Output Current: 0.02 A; Lifecycle Status: Active; Number of Pins: 8; Octopart Url: https://octopart.com/lm158aj-texas+instruments-64865023; OctopartID: 2c18e6cfcb81f3df; Packaging: Rail
R1#3 R2#4 R3#4 R4#3 R5#3 R6#4 R7#3 R8#3 = CMP-1857726-3: Res Thick Film 0805 100K Ohm 1% 1/8W ±100ppm/C Molded SMD Paper T/R; Lead-Free Status: Lead Free; Power Rating: 0.125 W; Case/Package (SI): 2012; Voltage Rating (DC): 150.0 V; Temperature Coefficient: 100.0 ppm/°C; Resistance: 100000.0 Ω; Mounting Style: Surface Mount; Number of Pins: 2; Case/Package: 0805; Resistance Tolerance: ±1%; OctopartID: 6231a9614adabdf6; Octopart Url: https://octopart.com/crcw0805100kfkea-vishay-39456141; REACH SVHC Compliance: No SVHC; RoHS: Compliant; Size-Width: 0.00125 m; Size-Length: 0.002 m; Size-Height: 0.00045 m

## Nets that join several sheets
GND: arduinoNew (17 pins), arduino (27 pins), Arduino-Pro-Mini (17 pins), magnetorquer_shield (op-amp1.4 op-amp2.4 op-amp3.4 op-amp4.4)
VCC: arduinoNew (15 pins), arduino (24 pins), Arduino-Pro-Mini (10 pins), magnetorquer_shield (8 pins)
N$2: arduinoNew (IC1#1.11 IC2#1.14 IC3#1.14 JP7#1.8), Arduino-Pro-Mini (JP7#2.8 U1#2.32)
N$5: arduinoNew (IC1#1.1 JP6#1.6), Arduino-Pro-Mini (JP6#2.6 U1#2.25)
N$6: arduinoNew (IC2#1.1 JP6#1.7), Arduino-Pro-Mini (JP6#2.7 U1#2.24)
N$7: arduinoNew (IC1#1.13 IC2#1.10 IC3#1.10 JP7#1.2), Arduino-Pro-Mini (JP7#2.2 U1#2.12)
N$41: arduinoNew (3-AXIS_GYRO#1.23 3-AXIS_MAG#1.1 JP2#1.1 R2#1.1), Arduino-Pro-Mini (JP2#4.2)
N$42: arduinoNew (IC3#1.1 JP6#1.8), Arduino-Pro-Mini (JP6#2.8 U1#2.23)
N$43: arduinoNew (6 pins), Arduino-Pro-Mini (JP2#4.1 JP7#2.4 U1#2.10)
N$72: arduinoNew (JP7#1.1 R7#1.2), Arduino-Pro-Mini (JP7#2.1 U1#2.13)
N$73: arduinoNew (JP7#1.5 R4#1.1), Arduino-Pro-Mini (JP7#2.5 U1#2.9)
N$75: arduinoNew (JP6#1.12 R6#1.2), Arduino-Pro-Mini (JP6#2.12 U1#2.14)
NetC19_A: arduinoNew (JP6#1.1), Arduino-Pro-Mini (C19.A JP6#2.1 U2.1 U2.3)
NetIC1#1_14: arduinoNew (IC1#1.14 IC2#1.11 IC3#1.11 JP7#1.3), Arduino-Pro-Mini (JP7#2.3 U1#2.11)
NetJP1#3_2: arduinoNew (JP7#1.12), Arduino-Pro-Mini (JP1#3.2 JP7#2.12 U1#2.31)
NetJP1#3_3: arduinoNew (JP7#1.11), Arduino-Pro-Mini (JP1#3.3 JP7#2.11 U1#2.30)
NetJP1#3_4: arduinoNew (JP6#1.4), Arduino-Pro-Mini (JP1#3.4 JP6#2.4)
NetJP3#1_1: arduinoNew (JP3#1.1), Arduino-Pro-Mini (JP3#4.1 U1#2.19)
NetJP3#1_2: arduinoNew (JP3#1.2), Arduino-Pro-Mini (JP3#4.2 U1#2.22)
NetJP6#1_3: arduinoNew (JP6#1.3 JP7#1.10), Arduino-Pro-Mini (JP6#2.3 JP7#2.10)
NetJP6#1_5: arduinoNew (JP6#1.5), Arduino-Pro-Mini (JP6#2.5 U1#2.26)
NetJP6#1_9: arduinoNew (JP6#1.9), Arduino-Pro-Mini (JP6#2.9 R6#3.1 U1#2.17)
NetJP6#1_10: arduinoNew (JP6#1.10), Arduino-Pro-Mini (JP6#2.10 U1#2.16)
NetJP6#1_11: arduinoNew (JP6#1.11), Arduino-Pro-Mini (JP6#2.11 U1#2.15)
NetJP7#1_6: arduinoNew (JP7#1.6), Arduino-Pro-Mini (JP7#2.6 U1#2.2)
NetJP7#1_7: arduinoNew (JP7#1.7), Arduino-Pro-Mini (JP7#2.7 U1#2.1)